# EAGLE design xns-ip67-ESP12 (EAGLE 8.0.2)
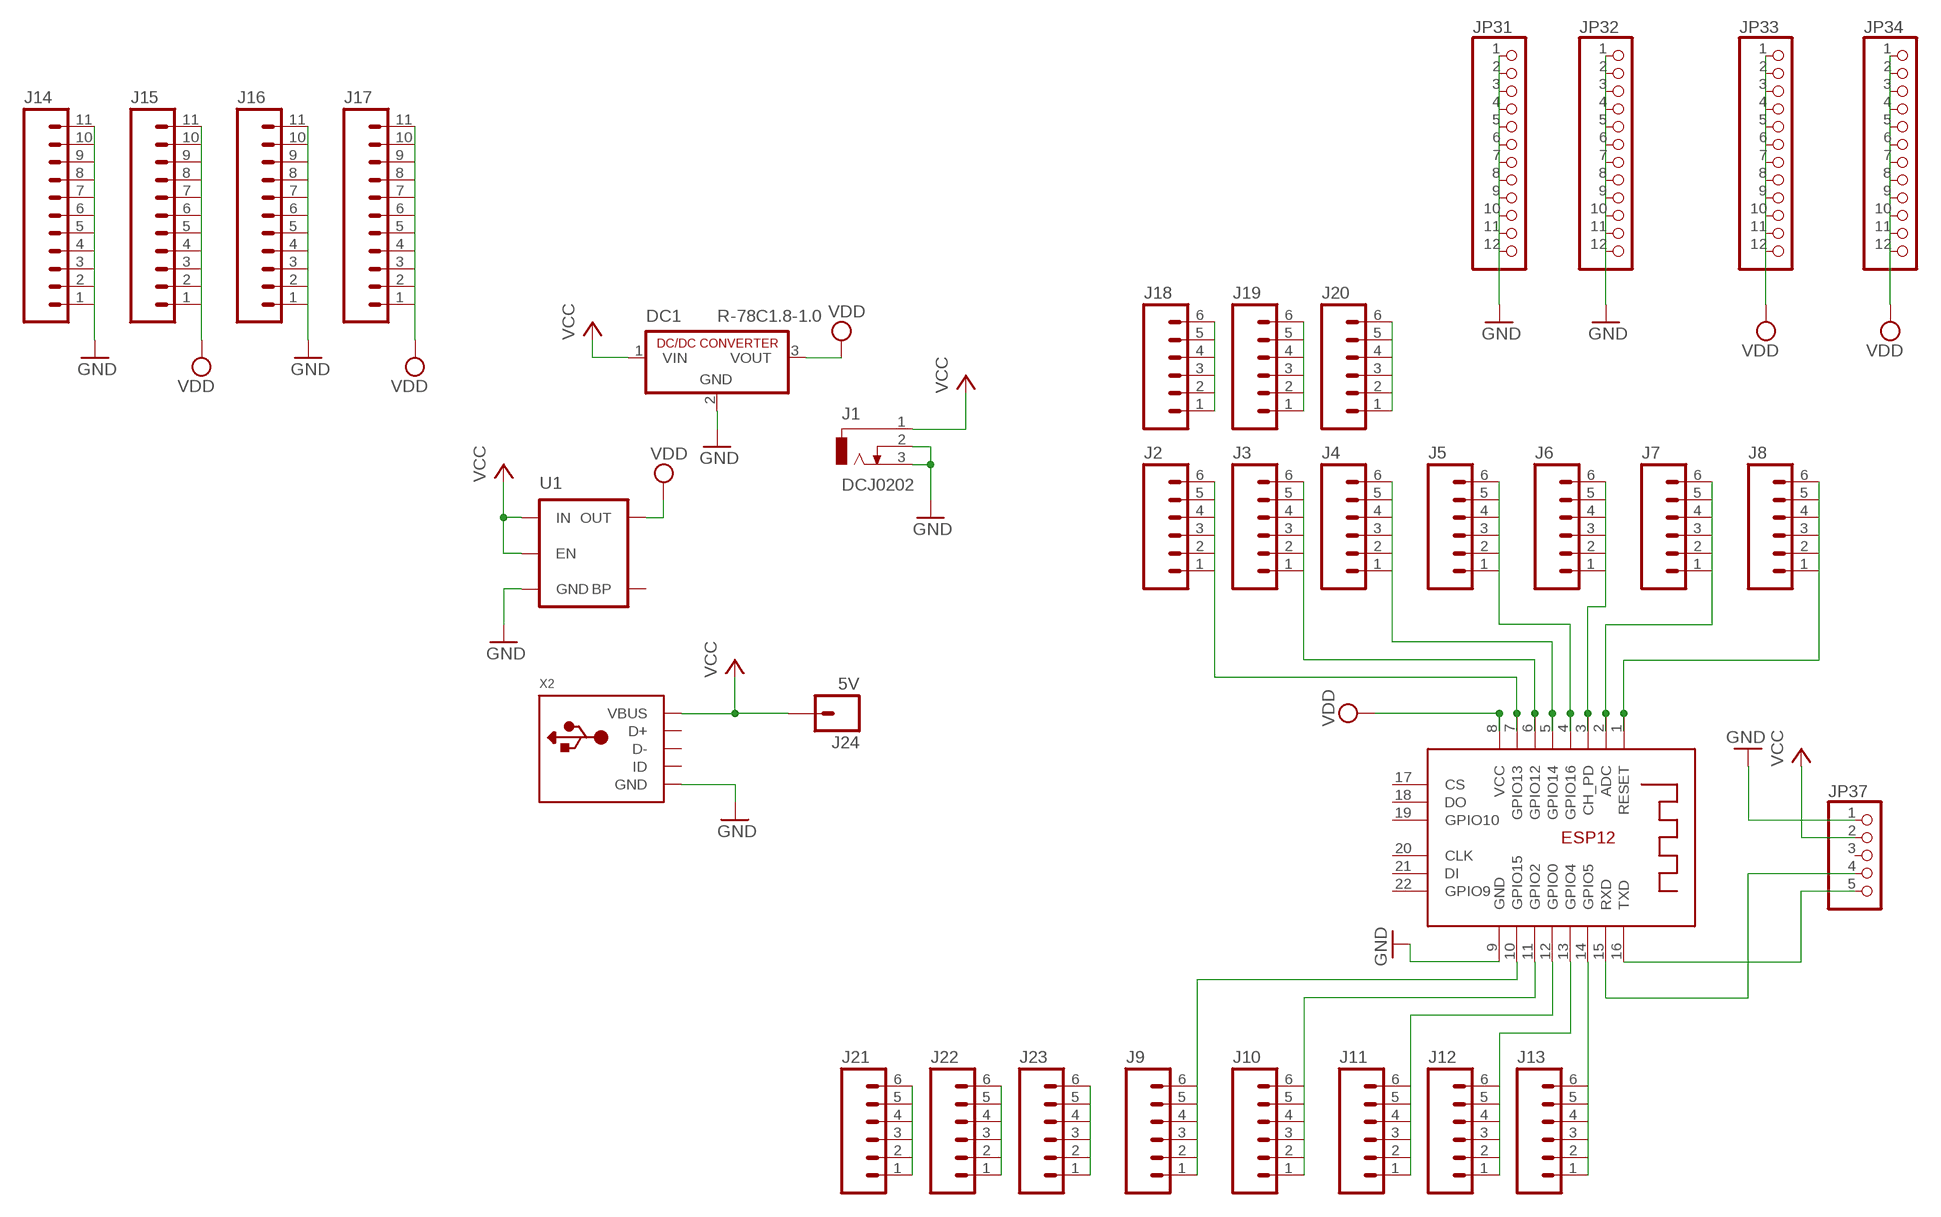
[diagram p0: schematic, sheet 1, part 1 of 2]
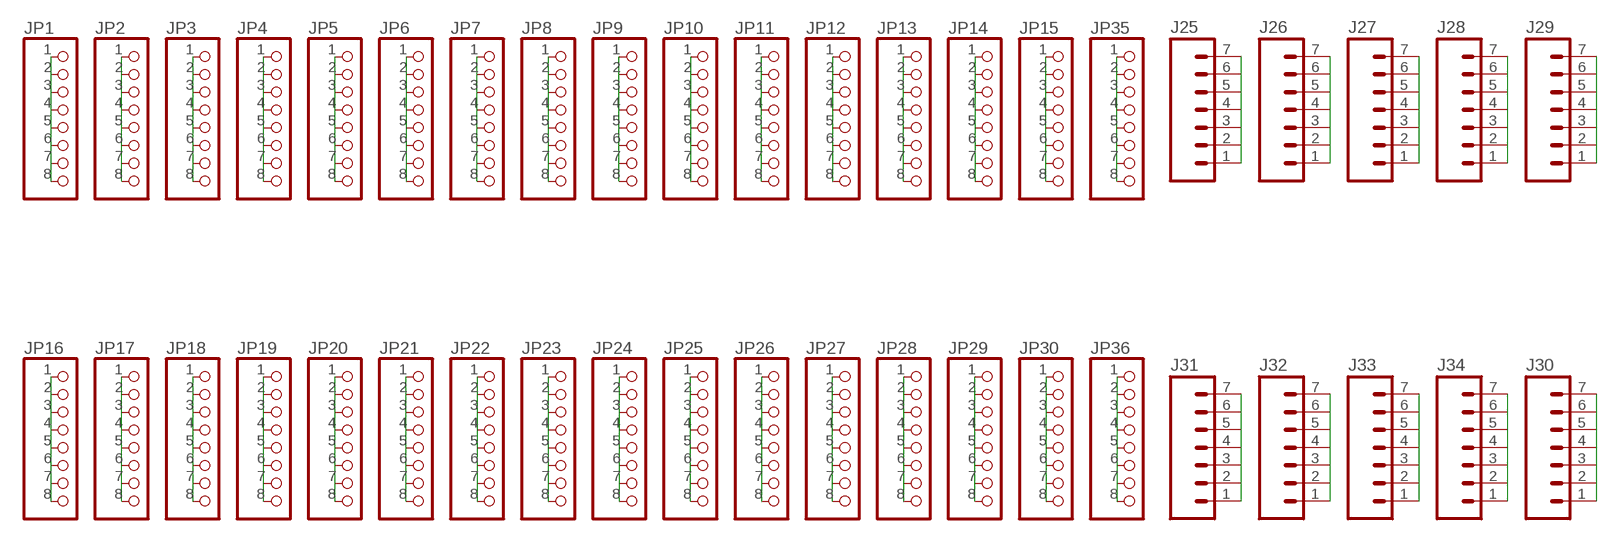
[diagram p1: schematic, sheet 1, part 2 of 2]

## Parts
DC1  R-78C1.8-1.0  [SIP3]
J1  DCJ0202  [DCJ0202]
J2  M06NO_SILK_FEMALE_PTH  [1X06_NO_SILK]
J3  M06NO_SILK_FEMALE_PTH  [1X06_NO_SILK]
J4  M06NO_SILK_FEMALE_PTH  [1X06_NO_SILK]
J5  M06NO_SILK_FEMALE_PTH  [1X06_NO_SILK]
J6  M06NO_SILK_FEMALE_PTH  [1X06_NO_SILK]
J7  M06NO_SILK_FEMALE_PTH  [1X06_NO_SILK]
J8  M06NO_SILK_FEMALE_PTH  [1X06_NO_SILK]
J9  M06NO_SILK_FEMALE_PTH  [1X06_NO_SILK]
J10  M06NO_SILK_FEMALE_PTH  [1X06_NO_SILK]
J11  M06NO_SILK_FEMALE_PTH  [1X06_NO_SILK]
J12  M06NO_SILK_FEMALE_PTH  [1X06_NO_SILK]
J13  M06NO_SILK_FEMALE_PTH  [1X06_NO_SILK]
J14  M111X11_NO_SILK  [1X11_NO_SILK]
J15  M111X11_NO_SILK  [1X11_NO_SILK]
J16  M111X11_NO_SILK  [1X11_NO_SILK]
J17  M111X11_NO_SILK  [1X11_NO_SILK]
J18  M06NO_SILK_FEMALE_PTH  [1X06_NO_SILK]
J19  M06NO_SILK_FEMALE_PTH  [1X06_NO_SILK]
J20  M06NO_SILK_FEMALE_PTH  [1X06_NO_SILK]
J21  M06NO_SILK_FEMALE_PTH  [1X06_NO_SILK]
J22  M06NO_SILK_FEMALE_PTH  [1X06_NO_SILK]
J23  M06NO_SILK_FEMALE_PTH  [1X06_NO_SILK]
J24  5V  M01PTH_NO_SILK_YES_STOP  [1X01_NO_SILK]
J25  M07NO_SILK  [1X07_NO_SILK]
J26  M07NO_SILK  [1X07_NO_SILK]
J27  M07NO_SILK  [1X07_NO_SILK]
J28  M07NO_SILK  [1X07_NO_SILK]
J29  M07NO_SILK  [1X07_NO_SILK]
J30  M07NO_SILK  [1X07_NO_SILK]
J31  M07NO_SILK  [1X07_NO_SILK]
J32  M07NO_SILK  [1X07_NO_SILK]
J33  M07NO_SILK  [1X07_NO_SILK]
J34  M07NO_SILK  [1X07_NO_SILK]
JP1  PINHD-1X8CLEANBIG  [1X08-CLEANBIG]
JP2  PINHD-1X8CLEANBIG  [1X08-CLEANBIG]
JP3  PINHD-1X8CLEANBIG  [1X08-CLEANBIG]
JP4  PINHD-1X8CLEANBIG  [1X08-CLEANBIG]
JP5  PINHD-1X8CLEANBIG  [1X08-CLEANBIG]
JP6  PINHD-1X8CLEANBIG  [1X08-CLEANBIG]
JP7  PINHD-1X8CLEANBIG  [1X08-CLEANBIG]
JP8  PINHD-1X8CLEANBIG  [1X08-CLEANBIG]
JP9  PINHD-1X8CLEANBIG  [1X08-CLEANBIG]
JP10  PINHD-1X8CLEANBIG  [1X08-CLEANBIG]
JP11  PINHD-1X8CLEANBIG  [1X08-CLEANBIG]
JP12  PINHD-1X8CLEANBIG  [1X08-CLEANBIG]
JP13  PINHD-1X8CLEANBIG  [1X08-CLEANBIG]
JP14  PINHD-1X8CLEANBIG  [1X08-CLEANBIG]
JP15  PINHD-1X8CLEANBIG  [1X08-CLEANBIG]
JP16  PINHD-1X8CLEANBIG  [1X08-CLEANBIG]
JP17  PINHD-1X8CLEANBIG  [1X08-CLEANBIG]
JP18  PINHD-1X8CLEANBIG  [1X08-CLEANBIG]
JP19  PINHD-1X8CLEANBIG  [1X08-CLEANBIG]
JP20  PINHD-1X8CLEANBIG  [1X08-CLEANBIG]
JP21  PINHD-1X8CLEANBIG  [1X08-CLEANBIG]
JP22  PINHD-1X8CLEANBIG  [1X08-CLEANBIG]
JP23  PINHD-1X8CLEANBIG  [1X08-CLEANBIG]
JP24  PINHD-1X8CLEANBIG  [1X08-CLEANBIG]
JP25  PINHD-1X8CLEANBIG  [1X08-CLEANBIG]
JP26  PINHD-1X8CLEANBIG  [1X08-CLEANBIG]
JP27  PINHD-1X8CLEANBIG  [1X08-CLEANBIG]
JP28  PINHD-1X8CLEANBIG  [1X08-CLEANBIG]
JP29  PINHD-1X8CLEANBIG  [1X08-CLEANBIG]
JP30  PINHD-1X8CLEANBIG  [1X08-CLEANBIG]
JP31  HEADER-1X12  [1X12_ROUND]
JP32  HEADER-1X12  [1X12_ROUND]
JP33  HEADER-1X12  [1X12_ROUND]
JP34  HEADER-1X12  [1X12_ROUND]
JP35  PINHD-1X8CLEANBIG  [1X08-CLEANBIG]
JP36  PINHD-1X8CLEANBIG  [1X08-CLEANBIG]
JP37  PINHD-1X5  [1X05]
U1  MIC52053.3V  [SOT23-5]
X1  ESP-12E  [ESP-12E]
X2  USBMICRO_20329  [4UCONN_20329]

## Nets
GND: DC1.2(GND) J1.2 J1.3 J14.1 J14.2 J14.3 J14.4 J14.5 J14.6 J14.7 J14.8 J14.9 J14.10 J14.11 J16.1 J16.2 J16.3 J16.4 J16.5 J16.6 J16.7 J16.8 J16.9 J16.10 J16.11 JP31.1 JP31.2 JP31.3 JP31.4 JP31.5 JP31.6 JP31.7 JP31.8 JP31.9 JP31.10 JP31.11 JP31.12 JP32.1 JP32.2 JP32.3 JP32.4 JP32.5 JP32.6 JP32.7 JP32.8 JP32.9 JP32.10 JP32.11 JP32.12 JP37.1 U1.2(GND) X1.9(GND) X2.BASE@1(GND) X2.BASE@2(GND) X2.GND X2.SPRT@1(GND) X2.SPRT@2(GND) X2.SPRT@3(GND) X2.SPRT@4(GND)
N$1: J2.1 J2.2 J2.3 J2.4 J2.5 J2.6 X1.7(GPIO13)
N$2: J3.1 J3.2 J3.3 J3.4 J3.5 J3.6 X1.6(GPIO12)
N$3: J4.1 J4.2 J4.3 J4.4 J4.5 J4.6 X1.5(GPIO14)
N$4: JP37.5 X1.16(TXD)
N$5: J5.1 J5.2 J5.3 J5.4 J5.5 J5.6 X1.4(GPIO16)
N$6: J6.1 J6.2 J6.3 J6.4 J6.5 J6.6 X1.3(CH_PD)
N$7: JP23.1 JP23.2 JP23.3 JP23.4 JP23.5 JP23.6 JP23.7 JP23.8
N$8: J7.1 J7.2 J7.3 J7.4 J7.5 J7.6 X1.2(ADC)
N$9: J8.1 J8.2 J8.3 J8.4 J8.5 J8.6 X1.1(RESET)
N$10: J9.1 J9.2 J9.3 J9.4 J9.5 J9.6 X1.10(GPIO15)
N$11: J10.1 J10.2 J10.3 J10.4 J10.5 J10.6 X1.11(GPIO2)
N$12: J11.1 J11.2 J11.3 J11.4 J11.5 J11.6 X1.12(GPIO0)
N$13: JP37.4 X1.15(RXD)
N$14: J12.1 J12.2 J12.3 J12.4 J12.5 J12.6 X1.13(GPIO4)
N$15: J13.1 J13.2 J13.3 J13.4 J13.5 J13.6 X1.14(GPIO5)
N$16: J18.1 J18.2 J18.3 J18.4 J18.5 J18.6
N$17: J19.1 J19.2 J19.3 J19.4 J19.5 J19.6
N$18: J20.1 J20.2 J20.3 J20.4 J20.5 J20.6
N$19: J21.1 J21.2 J21.3 J21.4 J21.5 J21.6
N$20: J22.1 J22.2 J22.3 J22.4 J22.5 J22.6
N$21: JP1.1 JP1.2 JP1.3 JP1.4 JP1.5 JP1.6 JP1.7 JP1.8
N$22: JP2.1 JP2.2 JP2.3 JP2.4 JP2.5 JP2.6 JP2.7 JP2.8
N$23: JP3.1 JP3.2 JP3.3 JP3.4 JP3.5 JP3.6 JP3.7 JP3.8
N$24: JP4.1 JP4.2 JP4.3 JP4.4 JP4.5 JP4.6 JP4.7 JP4.8
N$25: JP5.1 JP5.2 JP5.3 JP5.4 JP5.5 JP5.6 JP5.7 JP5.8
N$26: JP6.1 JP6.2 JP6.3 JP6.4 JP6.5 JP6.6 JP6.7 JP6.8
N$27: JP7.1 JP7.2 JP7.3 JP7.4 JP7.5 JP7.6 JP7.7 JP7.8
N$28: JP8.1 JP8.2 JP8.3 JP8.4 JP8.5 JP8.6 JP8.7 JP8.8
N$29: JP9.1 JP9.2 JP9.3 JP9.4 JP9.5 JP9.6 JP9.7 JP9.8
N$30: JP10.1 JP10.2 JP10.3 JP10.4 JP10.5 JP10.6 JP10.7 JP10.8
N$31: JP11.1 JP11.2 JP11.3 JP11.4 JP11.5 JP11.6 JP11.7 JP11.8
N$32: JP12.1 JP12.2 JP12.3 JP12.4 JP12.5 JP12.6 JP12.7 JP12.8
N$33: JP13.1 JP13.2 JP13.3 JP13.4 JP13.5 JP13.6 JP13.7 JP13.8
N$34: JP14.1 JP14.2 JP14.3 JP14.4 JP14.5 JP14.6 JP14.7 JP14.8
N$35: JP15.1 JP15.2 JP15.3 JP15.4 JP15.5 JP15.6 JP15.7 JP15.8
N$36: JP30.1 JP30.2 JP30.3 JP30.4 JP30.5 JP30.6 JP30.7 JP30.8
N$37: JP29.1 JP29.2 JP29.3 JP29.4 JP29.5 JP29.6 JP29.7 JP29.8
N$38: JP28.1 JP28.2 JP28.3 JP28.4 JP28.5 JP28.6 JP28.7 JP28.8
N$39: JP27.1 JP27.2 JP27.3 JP27.4 JP27.5 JP27.6 JP27.7 JP27.8
N$40: JP26.1 JP26.2 JP26.3 JP26.4 JP26.5 JP26.6 JP26.7 JP26.8
N$41: JP25.1 JP25.2 JP25.3 JP25.4 JP25.5 JP25.6 JP25.7 JP25.8
N$42: JP24.1 JP24.2 JP24.3 JP24.4 JP24.5 JP24.6 JP24.7 JP24.8
N$43: JP22.1 JP22.2 JP22.3 JP22.4 JP22.5 JP22.6 JP22.7 JP22.8
N$44: JP21.1 JP21.2 JP21.3 JP21.4 JP21.5 JP21.6 JP21.7 JP21.8
N$45: JP20.1 JP20.2 JP20.3 JP20.4 JP20.5 JP20.6 JP20.7 JP20.8
N$46: JP19.1 JP19.2 JP19.3 JP19.4 JP19.5 JP19.6 JP19.7 JP19.8
N$47: JP18.1 JP18.2 JP18.3 JP18.4 JP18.5 JP18.6 JP18.7 JP18.8
N$48: JP17.1 JP17.2 JP17.3 JP17.4 JP17.5 JP17.6 JP17.7 JP17.8
N$49: JP16.1 JP16.2 JP16.3 JP16.4 JP16.5 JP16.6 JP16.7 JP16.8
N$50: JP35.1 JP35.2 JP35.3 JP35.4 JP35.5 JP35.6 JP35.7 JP35.8
N$51: JP36.1 JP36.2 JP36.3 JP36.4 JP36.5 JP36.6 JP36.7 JP36.8
N$52: J31.1 J31.2 J31.3 J31.4 J31.5 J31.6 J31.7
N$54: J32.1 J32.2 J32.3 J32.4 J32.5 J32.6 J32.7
N$56: J33.1 J33.2 J33.3 J33.4 J33.5 J33.6 J33.7
N$58: J34.1 J34.2 J34.3 J34.4 J34.5 J34.6 J34.7
N$70: J23.1 J23.2 J23.3 J23.4 J23.5 J23.6
N$71: J25.1 J25.2 J25.3 J25.4 J25.5 J25.6 J25.7
N$72: J26.1 J26.2 J26.3 J26.4 J26.5 J26.6 J26.7
N$73: J27.1 J27.2 J27.3 J27.4 J27.5 J27.6 J27.7
N$74: J28.1 J28.2 J28.3 J28.4 J28.5 J28.6 J28.7
N$75: J29.1 J29.2 J29.3 J29.4 J29.5 J29.6 J29.7
N$76: J30.1 J30.2 J30.3 J30.4 J30.5 J30.6 J30.7
VCC: DC1.1(VIN) J1.1 J24.1 JP37.2 U1.1(IN) U1.3(EN) X2.VBUS
VDD: DC1.3(VOUT) J15.1 J15.2 J15.3 J15.4 J15.5 J15.6 J15.7 J15.8 J15.9 J15.10 J15.11 J17.1 J17.2 J17.3 J17.4 J17.5 J17.6 J17.7 J17.8 J17.9 J17.10 J17.11 JP33.1 JP33.2 JP33.3 JP33.4 JP33.5 JP33.6 JP33.7 JP33.8 JP33.9 JP33.10 JP33.11 JP33.12 JP34.1 JP34.2 JP34.3 JP34.4 JP34.5 JP34.6 JP34.7 JP34.8 JP34.9 JP34.10 JP34.11 JP34.12 U1.5(OUT) X1.8(VCC)
Unconnected: JP37.3 U1.4(BP) X1.17(CS) X1.18(DO) X1.19(GPIO10) X1.20(CLK) X1.21(DI) X1.22(GPIO9) X2.D+ X2.D- X2.ID

## Library data of the parts
DC1 = dc-dc-converter:R-78C*-1.0: INNOLINE DC/DC-Converter 1.0 AMP SIP3 Single Output Source: Data sheet <http://www.mikrocontroller.net/attachment/150645/157764-da-01-en-DC_DC_WANDLER_R_78C5_0_1_0.pdf>
J1 = con-jack:DCJ0202: DC POWER JACK Source: DCJ0202.pdf; OC_FARNELL: unknown; OC_NEWARK: unknown
J2-J13 J18-J23 = SparkFun-Connectors:M06: Header 6 Standard 6-pin 0.1" header. Use with straight break away headers (SKU : PRT-00116), right angle break away headers (PRT-00553), swiss pins (PRT-00743), machine pins (PRT-00117), and female headers (PRT-00115). Molex polarized connector foot print use with SKU : PRT-08094 with associated crimp pins and housings. NOTES ON THE VARIANTS LOCK and LOCK_LONGPADS... This footprint was designed to help hold the alignment of a through-hole component (i.e. 6-pin header) while soldering it into place. You may notice that each hole has been shifted either up or down by 0.005 of an inch from it's more standard position (which is a perfectly straight line). This slight alteration caused the pins (the squares in the middle) to touch the edges of the holes. Because they are alternating, it causes a "brace" to hold the component in place. 0.005 has proven to be the perfect amount of "off-center" position when using our standard breakaway headers. Although looks a little odd when you look at the bare footprint, once you have a header in there, the alteration is very hard to notice. Also,if you push a header all the way into place, it is covered up entirely on the bottom side. This idea of altering the position of holes to aid alignment will be further integrated into the Sparkfun Library for other footprints. It can help hold any component with 3 or more connection pins.; PROD_ID: CONN-08437
J14-J17 = SparkFun-Connectors:M11: Header 11 Standard 11-pin 0.1" header. Use with straight break away headers (SKU : PRT-00116), right angle break away headers (PRT-00553), swiss pins (PRT-00743), machine pins (PRT-00117), and female headers (PRT-00115).
J24 = SparkFun-Connectors:M01: Header 1 Standard 1-pin 0.1" header. Use with straight break away headers (SKU : PRT-00116), right angle break away headers (PRT-00553), swiss pins (PRT-00743), machine pins (PRT-00117), and female headers (PRT-00115). SMTSO-256-ET is a "flush mount" nut for a 4-40 screw. The older package used to be too tight, and did not allow it to sit properly thru the drill hit. The latest (0.165DIA) fits nice and snug.
J25-J34 = SparkFun-Connectors:M07: Header 7 Standard 7-pin 0.1" header. Use with straight break away headers (SKU : PRT-00116), right angle break away headers (PRT-00553), swiss pins (PRT-00743), machine pins (PRT-00117), and female headers (PRT-00115). NOTES ON THE VARIANTS LOCK and LOCK_LONGPADS... This footprint was designed to help hold the alignment of a through-hole component (i.e. 7-pin header) while soldering it into place. You may notice that each hole has been shifted either up or down by 0.005 of an inch from it's more standard position (which is usually a perfectly straight line). This slight alteration caused the pins (the squares in the middle) to touch the edges of the holes. Because they are alternating, it causes a "brace" to hold the header in place. 0.005 has proven to be the perfect amount of "off-center" position when using our standard breakaway headers. Although looks a little odd when you look at the bare footprint, once you have a header in there, the alteration is very hard to notice. Also, if you push a header all the way into place, it is covered up entirely on the bottom side. This idea of altering the position of holes to aid alignment will be further integrated into the Sparkfun Library for other footprints. It can help hold any component with 3 or more connection pins.
JP1-JP30 JP35 JP36 = adafruit:PINHD-1X8: PIN HEADER
JP31-JP34 = microbuilder:HEADER-1X12
JP37 = pinhead:PINHD-1X5: PIN HEADER
U1 = SparkFun-PowerIC:MIC5205: MIC5205 150mA vreg 3.3V - VREG-00822 5V - VREG-00823; PROD_ID: VREG-00822
X1 = microbuilder:ESP-12E
X2 = microbuilder:USB: USB Connectors USBMINIB - Surface Mount Female Mini-B USB Connector 4UConnector: 06564

## Net classes
0 default: width 0.508 mm, drill 0.508 mm, clearance 0.254 mm

## Board
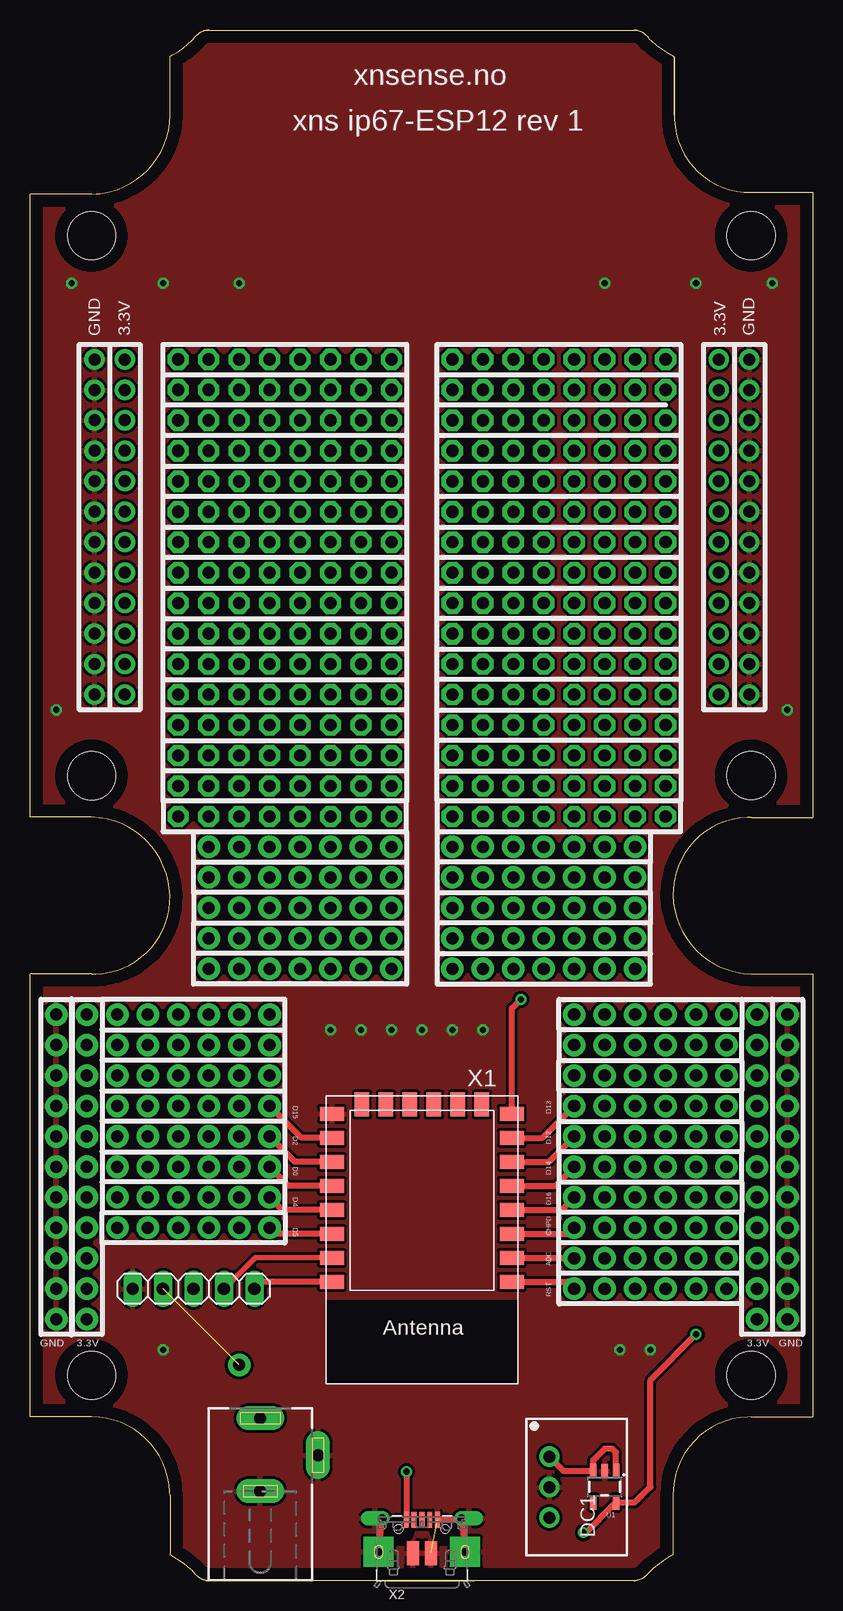
[diagram p2: board, top side]
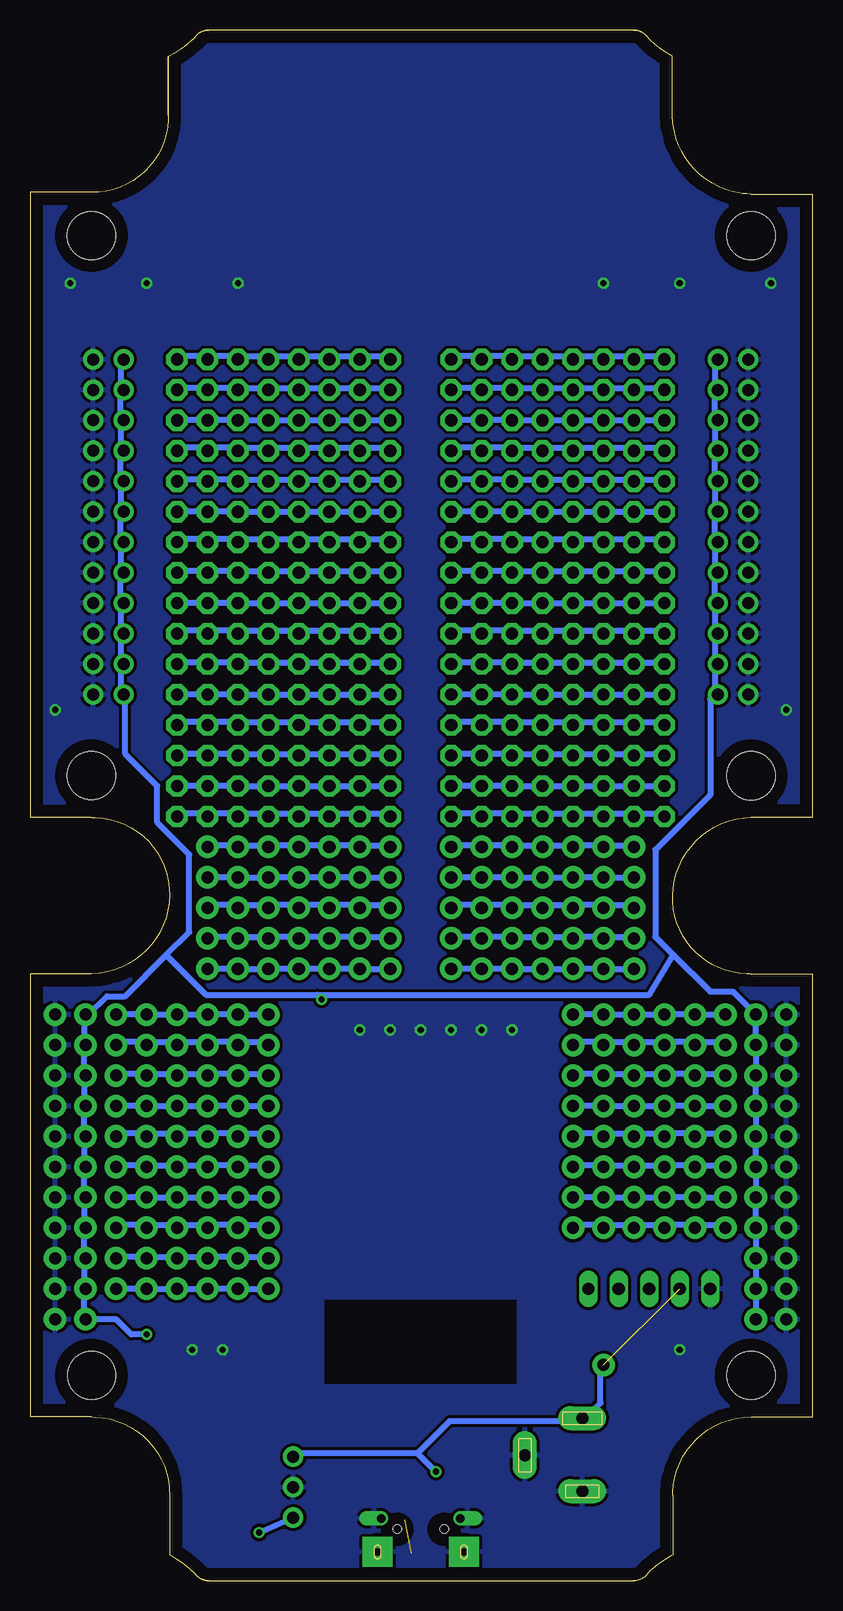
[diagram p3: board, bottom side, seen from below]

Size 65.26 x 129.28 mm. Coordinates in mm from the lower left corner, seen from the top.
Outline: 13.87,128.8 arc-48 14.94,129.28 50.35,129.28
Outline: 51.42,128.8 arc48 50.35,129.28
Outline: 51.41,0.49 arc-48 50.35,0.02 14.94,0.02
Outline: 13.88,0.48 arc48 14.94,0
Outline: 53.72,122.19 53.72,127.05
Outline: 50.34,129.28 50.36,129.28 arc-41 51.27,128.94 arc-10 51.55,128.65 arc10 51.78,128.41 arc13 53.73,127.04 53.73,122.3 arc2 53.74,121.8 arc88 60.13,115.74 65.26,115.74 65.26,63.65 60.14,63.65
Outline: 60.13,63.65 59.81,63.64 arc89 53.62,57.14 arc88 60.13,50.61 65.26,50.61 65.26,13.66 60.13,13.66 59.82,13.65 arc89 53.62,7.11 53.62,2.19 53.53,2.14 arc17 51.51,0.59 arc-8 51.14,0.26 arc-17 50.87,0.11 arc-19 50.42,0.02 14.95,0.02 arc-52 13.73,0.62 arc11 13.39,0.98 arc10 11.68,2.17
Outline: 11.67,2.18 11.67,7.13 11.66,7.39 arc88 5.13,13.67 0,13.67 0,50.6 5.14,50.6 5.5,50.61 arc90 11.67,57.14 arc87 5.14,63.66 0.01,63.66 0.01,115.61 5.14,115.61 5.5,115.62 arc7 6.05,115.67 arc80 11.68,122.13 11.68,127.08 11.91,127.21 arc19 13.87,128.79 arc-47 14.93,129.28 50.33,129.28
Copper layers (1*16): Top 0.035mm / dielectric 1.5mm / Bottom 0.035mm
Design rules "default *": minimum track width 0.5mm, minimum drill 20mil, track to track 8mil, track to pad 8mil, pad to pad 8mil, via to via 8mil, smd to smd 8mil, copper to edge 40mil, drill to drill 8mil, minimum pad ring 10mil, minimum via ring 8mil, stop-mask expansion 4mil, vias tented up to drill 0mil, thermal gap 10mil
Holes 4 mm at 5.14,112.13 60.13,112.14 5.14,67.12 60.13,67.13 5.14,17.14 60.12,17.14

### Footprints (pad centres in the part's own frame; a part is rotated, then mirrored left to right if it is on the bottom)
SIP3 = drill 1 pad 1.676: 1 -2.54,0; 2 0,0; 3 2.54,0
DCJ0202 = drill 1 pad 2 long: 1 0,3.1; 2 4.8,0; 3 0,-3
1X06_NO_SILK = drill 1.016 pad 1.88: 1 0,0; 2 2.54,0; 3 5.08,0; 4 7.62,0; 5 10.16,0; 6 12.7,0
1X11_NO_SILK = drill 1.016 pad 1.88: 1 0,0; 2 2.54,0; 3 5.08,0; 4 7.62,0; 5 10.16,0; 6 12.7,0; 7 15.24,0; 8 17.78,0; 9 20.32,0; 10 22.86,0; 11 25.4,0
1X01_NO_SILK = drill 1.016 pad 1.88: 1 0,0
1X07_NO_SILK = drill 1.016 pad 1.88: 1 0,0; 2 2.54,0; 3 5.08,0; 4 7.62,0; 5 10.16,0; 6 12.7,0; 7 15.24,0
1X08-CLEANBIG = drill 1.016 pad 1.778 octagon: 1 -8.89,0; 2 -6.35,0; 3 -3.81,0; 4 -1.27,0; 5 1.27,0; 6 3.81,0; 7 6.35,0; 8 8.89,0
1X12_ROUND = drill 1 pad 1.676: 1 -13.97,0; 2 -11.43,0; 3 -8.89,0; 4 -6.35,0; 5 -3.81,0; 6 -1.27,0; 7 1.27,0; 8 3.81,0; 9 6.35,0; 10 8.89,0; 11 11.43,0; 12 13.97,0
1X05 = drill 1.016 long: 1 -5.08,0; 2 -2.54,0; 3 0,0; 4 2.54,0; 5 5.08,0
SOT23-5 = smd 0.55 x 1.2: 1 -0.95,-1.3; 2 0,-1.3; 3 0.95,-1.3; 4 0.95,1.3; 5 -0.95,1.3
ESP-12E = smd 2 x 1.2: 1 -7.5,5.77; 2 -7.5,3.77; 3 -7.5,1.77; 4 -7.5,-0.23; 5 -7.5,-2.23; 6 -7.5,-4.23; 7 -7.5,-6.23; 8 -7.5,-8.23; 9 7.5,-8.23; 10 7.5,-6.23; 11 7.5,-4.23; 12 7.5,-2.23; 13 7.5,-0.23; 14 7.5,1.77; 15 7.5,3.77; 16 7.5,5.77 | smd 1.2 x 2: 17 -5,-9; 18 -3,-9; 19 -1,-9; 20 1,-9; 21 3,-9; 22 5,-9
4UCONN_20329 = smd 1 x 2: BASE@1 -0.75,-2; BASE@2 0.75,-2 | smd 0.4 x 1.35: D+ 0,0.775; D- -0.65,0.775; GND 1.3,0.775; ID 0.65,0.775; VBUS -1.3,0.775 | drill 0.7 offset: SPRT@1 -3.3,0.9; SPRT@2 3.3,0.9 | drill 0.6 pad 2.5 square: SPRT@3 -3.6,-1.9; SPRT@4 3.6,-1.9 | hole 0.7: -1.95,0; 1.95,0

### Placement (x,y rotation side)
DC1  43.31,7.82 270 top
J1  19.2,10.47 0 top
J2  45.38,39.59 0 top
J3  45.38,37.05 0 top
J4  45.38,34.51 0 top
J5  45.38,31.97 0 top
J6  45.38,29.43 0 top
J7  45.38,26.89 0 top
J8  45.38,24.35 0 top
J9  7.28,39.59 0 top
J10  7.28,37.05 0 top
J11  7.28,34.51 0 top
J12  7.28,31.97 0 top
J13  7.28,29.43 0 top
J14  2.2,21.81 90 top
J15  4.74,21.81 90 top
J16  63.16,21.81 90 top
J17  60.62,21.81 90 top
J18  7.28,47.21 0 top
J19  7.28,44.67 0 top
J20  7.28,42.13 0 top
J21  45.38,47.21 0 top
J22  45.38,44.67 0 top
J23  45.38,42.13 0 top
J24  17.44,18 0 top
J25  14.9,61.18 0 top
J26  14.9,58.64 0 top
J27  14.9,56.1 0 top
J28  14.9,53.56 0 top
J29  14.9,51.02 0 top
J30  35.22,61.18 0 top
J31  35.22,58.64 0 top
J32  35.22,56.1 0 top
J33  35.22,53.56 0 top
J34  35.22,51.02 0 top
JP1  21.25,101.82 0 top
JP2  21.25,99.28 0 top
JP3  21.25,96.74 0 top
JP4  21.25,94.2 0 top
JP5  21.25,91.66 0 top
JP6  21.25,89.12 0 top
JP7  21.25,86.58 0 top
JP8  21.25,84.04 0 top
JP9  21.25,81.5 0 top
JP10  21.25,78.96 0 top
JP11  21.25,76.42 0 top
JP12  21.25,73.88 0 top
JP13  21.25,71.34 0 top
JP14  21.25,68.8 0 top
JP15  21.25,66.26 0 top
JP16  44.11,66.26 0 top
JP17  44.11,68.8 0 top
JP18  44.11,71.34 0 top
JP19  44.11,73.88 0 top
JP20  44.11,76.42 0 top
JP21  44.11,78.96 0 top
JP22  44.11,81.5 0 top
JP23  44.11,84.04 0 top
JP24  44.11,86.58 0 top
JP25  44.11,89.12 0 top
JP26  44.11,91.66 0 top
JP27  44.11,94.2 0 top
JP28  44.11,96.74 0 top
JP29  44.11,99.28 0 top
JP30  44.11,101.82 0 top
JP31  5.38,87.85 90 top
JP32  59.98,87.85 90 top
JP33  57.44,87.85 90 top
JP34  7.91,87.85 90 top
JP35  21.25,63.72 0 top
JP36  44.11,63.72 0 top
JP37  13.63,24.35 0 top
U1  47.92,7.84 180 top
X1  32.68,30.7 180 top
X2  32.68,4.31 0 top

### Tracks (layer width: path | path; a pad name or v marks a point on that pad's centre or on a via)
GND  (via drill 0.51)  (1 unrouted)
  Top 0.508: X2.SPRT@3 X2.SPRT@1 | X2.GND X2.SPRT@2 X2.SPRT@4
  other vias: 3.47,108.17 11.09,108.17 2.2,72.61 17.44,108.17 11.09,19.27 49.19,19.27 51.73,19.27 63.16,72.61 47.92,108.17 55.54,108.17 61.89,108.17 25.06,45.94 27.6,45.94 32.68,45.94 30.14,45.94 35.22,45.94 37.76,45.94
  pour Bottom: -5.42,-1.05 68.24,-1.05 68.24,132.3 -5.42,132.3
  pour Top: -4.15,133.57 68.24,133.57 68.24,-2.32 -4.15,-2.32
N$1
  Top 0.508: X1.7 42.72,36.93 J2.1
  Bottom 0.508: J2.1 J2.2 J2.3 J2.4 J2.5 J2.6
N$2
  Top 0.508: X1.6 43.26,34.93 J3.1
  Bottom 0.508: J3.1 45.51,37.31 47.79,37.31 J3.2 48.17,37.31 50.46,37.31 | J3.6 58.08,37.31 55.79,37.31 J3.5 55.41,37.31 53.13,37.31 J3.4 52.75,37.31 50.46,37.31 | 50.46,37.31 J3.3
N$3
  Top 0.508: X1.5 43.8,32.93 J4.1
  Bottom 0.508: J4.1 45.51,34.64 47.79,34.64 J4.2 48.17,34.64 50.46,34.64 | J4.6 58.08,34.64 55.79,34.64 J4.5 55.41,34.64 53.13,34.64 J4.4 52.75,34.64 50.46,34.64 | 50.46,34.64 J4.3
N$4
  Top 0.508: X1.16 19.4,24.93 JP37.5
N$5
  Top 0.508: X1.4 44.34,30.93 J5.1
  Bottom 0.508: J5.1 J5.2 J5.3 J5.4 J5.5 J5.6
N$6
  Top 0.508: X1.3 44.88,28.93 J6.1
  Bottom 0.508: J6.1 45.51,29.69 47.79,29.69 J6.2 48.17,29.69 50.46,29.69 | J6.6 58.08,29.69 55.79,29.69 J6.5 55.41,29.69 53.13,29.69 J6.4 52.75,29.69 50.46,29.69 | 50.46,29.69 J6.3
N$7
  Bottom 0.508: JP23.1 35.22,84.17 37.51,84.17 JP23.2 37.89,84.17 40.17,84.17 JP23.3 40.55,84.17 42.84,84.17 | 50.46,84.17 48.17,84.17 JP23.6 47.79,84.17 45.51,84.17 JP23.5 45.13,84.17 42.84,84.17 | 50.46,84.17 52.75,84.17 JP23.8 | 50.46,84.17 JP23.7 | 42.84,84.17 JP23.4
N$8
  Top 0.508: 45.35,26.86 J7.1 45.34,26.93 X1.2
  Bottom 0.508: J7.1 45.51,27.02 47.79,27.02 J7.2 48.17,27.02 50.46,27.02 | J7.6 58.08,27.02 55.79,27.02 J7.5 55.41,27.02 53.13,27.02 J7.4 52.75,27.02 50.46,27.02 | 50.46,27.02 J7.3
N$9
  Top 0.508: X1.1 44.8,24.93 J8.1
  Bottom 0.508: J8.1 J8.2 J8.3 J8.4 J8.5 J8.6
N$10
  Top 0.508: X1.10 22.64,36.93 J9.6
  Bottom 0.508: J9.1 J9.2 J9.3 J9.4 J9.5 J9.6
N$11
  Top 0.508: X1.11 22.1,34.93 J10.6
  Bottom 0.508: J10.1 7.41,37.31 9.69,37.31 J10.2 10.07,37.31 12.36,37.31 | J10.6 19.98,37.31 17.69,37.31 J10.5 17.31,37.31 15.03,37.31 J10.4 14.65,37.31 12.36,37.31 | 12.36,37.31 J10.3
N$12
  Top 0.508: X1.12 21.56,32.93 J11.6
  Bottom 0.508: J11.1 7.41,34.64 9.69,34.64 J11.2 10.07,34.64 12.36,34.64 | J11.6 19.98,34.64 17.69,34.64 J11.5 17.31,34.64 15.03,34.64 J11.4 14.65,34.64 12.36,34.64 | 12.36,34.64 J11.3
N$13
  Top 0.406: X1.15 18.75,26.93 JP37.4
N$14
  Top 0.508: X1.13 21.02,30.93 J12.6
  Bottom 0.508: J12.1 J12.2 J12.3 J12.4 J12.5 J12.6
N$15
  Top 0.508: X1.14 20.48,28.93 J13.6
  Bottom 0.508: J13.1 7.41,29.69 9.69,29.69 J13.2 10.07,29.69 12.36,29.69 | J13.6 19.98,29.69 17.69,29.69 J13.5 17.31,29.69 15.03,29.69 J13.4 14.65,29.69 12.36,29.69 | 12.36,29.69 J13.3
N$16
  Bottom 0.508: J18.1 J18.2 J18.3 J18.4 J18.5 J18.6
N$17
  Bottom 0.508: J19.1 7.41,44.93 9.69,44.93 J19.2 10.07,44.93 12.36,44.93 | J19.6 19.98,44.93 17.69,44.93 J19.5 17.31,44.93 15.03,44.93 J19.4 14.65,44.93 12.36,44.93 | 12.36,44.93 J19.3
N$18
  Bottom 0.508: J20.1 7.41,42.26 9.69,42.26 J20.2 10.07,42.26 12.36,42.26 | J20.6 19.98,42.26 17.69,42.26 J20.5 17.31,42.26 15.03,42.26 J20.4 14.65,42.26 12.36,42.26 | 12.36,42.26 J20.3
N$19
  Bottom 0.508: J21.1 J21.2 J21.3 J21.4 J21.5 J21.6
N$20
  Bottom 0.508: J22.1 45.51,44.93 47.79,44.93 J22.2 48.17,44.93 50.46,44.93 | J22.6 58.08,44.93 55.79,44.93 J22.5 55.41,44.93 53.13,44.93 J22.4 52.75,44.93 50.46,44.93 | 50.46,44.93 J22.3
N$21
  Bottom 0.508: JP1.1 12.36,102.08 14.65,102.08 JP1.2 15.03,102.08 17.31,102.08 JP1.3 17.69,102.08 19.98,102.08 | 27.6,102.08 25.31,102.08 JP1.6 24.93,102.08 22.65,102.08 JP1.5 22.27,102.08 19.98,102.08 | 27.6,102.08 29.89,102.08 JP1.8 | 27.6,102.08 JP1.7 | 19.98,102.08 JP1.4
N$22
  Bottom 0.508: JP2.1 12.36,99.41 14.65,99.41 JP2.2 15.03,99.41 17.31,99.41 JP2.3 17.69,99.41 19.98,99.41 | 27.6,99.41 25.31,99.41 JP2.6 24.93,99.41 22.65,99.41 JP2.5 22.27,99.41 19.98,99.41 | 27.6,99.41 29.89,99.41 JP2.8 | 27.6,99.41 JP2.7 | 19.98,99.41 JP2.4
N$23
  Bottom 0.508: JP3.1 JP3.2 JP3.3 JP3.4 JP3.5 JP3.6 JP3.7 JP3.8
N$24
  Bottom 0.508: JP4.1 12.36,94.46 14.65,94.46 JP4.2 15.03,94.46 17.31,94.46 JP4.3 17.69,94.46 19.98,94.46 | 27.6,94.46 25.31,94.46 JP4.6 24.93,94.46 22.65,94.46 JP4.5 22.27,94.46 19.98,94.46 | 27.6,94.46 29.89,94.46 JP4.8 | 27.6,94.46 JP4.7 | 19.98,94.46 JP4.4
N$25
  Bottom 0.508: JP5.1 12.36,91.79 14.65,91.79 JP5.2 15.03,91.79 17.31,91.79 JP5.3 17.69,91.79 19.98,91.79 | 27.6,91.79 25.31,91.79 JP5.6 24.93,91.79 22.65,91.79 JP5.5 22.27,91.79 19.98,91.79 | 27.6,91.79 29.89,91.79 JP5.8 | 27.6,91.79 JP5.7 | 19.98,91.79 JP5.4
N$26
  Bottom 0.508: JP6.1 JP6.2 JP6.3 JP6.4 JP6.5 JP6.6 JP6.7 JP6.8
N$27
  Bottom 0.508: JP7.1 12.36,86.84 14.65,86.84 JP7.2 15.03,86.84 17.31,86.84 JP7.3 17.69,86.84 19.98,86.84 | 27.6,86.84 25.31,86.84 JP7.6 24.93,86.84 22.65,86.84 JP7.5 22.27,86.84 19.98,86.84 | 27.6,86.84 29.89,86.84 JP7.8 | 27.6,86.84 JP7.7 | 19.98,86.84 JP7.4
N$28
  Bottom 0.508: JP8.1 12.36,84.17 14.65,84.17 JP8.2 15.03,84.17 17.31,84.17 JP8.3 17.69,84.17 19.98,84.17 | 27.6,84.17 25.31,84.17 JP8.6 24.93,84.17 22.65,84.17 JP8.5 22.27,84.17 19.98,84.17 | 27.6,84.17 29.89,84.17 JP8.8 | 27.6,84.17 JP8.7 | 19.98,84.17 JP8.4
N$29
  Bottom 0.508: JP9.1 JP9.2 JP9.3 JP9.4 JP9.5 JP9.6 JP9.7 JP9.8
N$30
  Bottom 0.508: JP10.1 12.36,79.22 14.65,79.22 JP10.2 15.03,79.22 17.31,79.22 JP10.3 17.69,79.22 19.98,79.22 | 27.6,79.22 25.31,79.22 JP10.6 24.93,79.22 22.65,79.22 JP10.5 22.27,79.22 19.98,79.22 | 27.6,79.22 29.89,79.22 JP10.8 | 27.6,79.22 JP10.7 | 19.98,79.22 JP10.4
N$31
  Bottom 0.508: JP11.1 12.36,76.55 14.65,76.55 JP11.2 15.03,76.55 17.31,76.55 JP11.3 17.69,76.55 19.98,76.55 | 27.6,76.55 25.31,76.55 JP11.6 24.93,76.55 22.65,76.55 JP11.5 22.27,76.55 19.98,76.55 | 27.6,76.55 29.89,76.55 JP11.8 | 27.6,76.55 JP11.7 | 19.98,76.55 JP11.4
N$32
  Bottom 0.508: JP12.1 JP12.2 JP12.3 JP12.4 JP12.5 JP12.6 JP12.7 JP12.8
N$33
  Bottom 0.508: JP13.1 12.36,71.6 14.65,71.6 JP13.2 15.03,71.6 17.31,71.6 JP13.3 17.69,71.6 19.98,71.6 | 27.6,71.6 25.31,71.6 JP13.6 24.93,71.6 22.65,71.6 JP13.5 22.27,71.6 19.98,71.6 | 27.6,71.6 29.89,71.6 JP13.8 | 27.6,71.6 JP13.7 | 19.98,71.6 JP13.4
N$34
  Bottom 0.508: JP14.1 12.36,68.93 14.65,68.93 JP14.2 15.03,68.93 17.31,68.93 JP14.3 17.69,68.93 19.98,68.93 | 27.6,68.93 25.31,68.93 JP14.6 24.93,68.93 22.65,68.93 JP14.5 22.27,68.93 19.98,68.93 | 27.6,68.93 29.89,68.93 JP14.8 | 27.6,68.93 JP14.7 | 19.98,68.93 JP14.4
N$35
  Bottom 0.508: JP15.1 JP15.2 JP15.3 JP15.4 JP15.5 JP15.6 JP15.7 JP15.8
N$36
  Bottom 0.508: JP30.1 35.22,102.08 37.51,102.08 JP30.2 37.89,102.08 40.17,102.08 JP30.3 40.55,102.08 42.84,102.08 | 50.46,102.08 48.17,102.08 JP30.6 47.79,102.08 45.51,102.08 JP30.5 45.13,102.08 42.84,102.08 | 50.46,102.08 52.75,102.08 JP30.8 | 50.46,102.08 JP30.7 | 42.84,102.08 JP30.4
N$37
  Bottom 0.508: JP29.1 35.22,99.41 37.51,99.41 JP29.2 37.89,99.41 40.17,99.41 JP29.3 40.55,99.41 42.84,99.41 | 50.46,99.41 48.17,99.41 JP29.6 47.79,99.41 45.51,99.41 JP29.5 45.13,99.41 42.84,99.41 | 50.46,99.41 52.75,99.41 JP29.8 | 50.46,99.41 JP29.7 | 42.84,99.41 JP29.4
N$38
  Bottom 0.508: JP28.1 JP28.2 JP28.3 JP28.4 JP28.5 JP28.6 JP28.7 JP28.8
N$39
  Bottom 0.508: JP27.1 35.22,94.46 37.51,94.46 JP27.2 37.89,94.46 40.17,94.46 JP27.3 40.55,94.46 42.84,94.46 | 50.46,94.46 48.17,94.46 JP27.6 47.79,94.46 45.51,94.46 JP27.5 45.13,94.46 42.84,94.46 | 50.46,94.46 52.75,94.46 JP27.8 | 50.46,94.46 JP27.7 | 42.84,94.46 JP27.4
N$40
  Bottom 0.508: JP26.1 35.22,91.79 37.51,91.79 JP26.2 37.89,91.79 40.17,91.79 JP26.3 40.55,91.79 42.84,91.79 | 50.46,91.79 48.17,91.79 JP26.6 47.79,91.79 45.51,91.79 JP26.5 45.13,91.79 42.84,91.79 | 50.46,91.79 52.75,91.79 JP26.8 | 50.46,91.79 JP26.7 | 42.84,91.79 JP26.4
N$41
  Bottom 0.508: JP25.1 JP25.2 JP25.3 JP25.4 JP25.5 JP25.6 JP25.7 JP25.8
N$42
  Bottom 0.508: JP24.1 35.22,86.84 37.51,86.84 JP24.2 37.89,86.84 40.17,86.84 JP24.3 40.55,86.84 42.84,86.84 | 50.46,86.84 48.17,86.84 JP24.6 47.79,86.84 45.51,86.84 JP24.5 45.13,86.84 42.84,86.84 | 50.46,86.84 52.75,86.84 JP24.8 | 50.46,86.84 JP24.7 | 42.84,86.84 JP24.4
N$43
  Bottom 0.508: JP22.1 JP22.2 JP22.3 JP22.4 JP22.5 JP22.6 JP22.7 JP22.8
N$44
  Bottom 0.508: JP21.1 35.22,79.22 37.51,79.22 JP21.2 37.89,79.22 40.17,79.22 JP21.3 40.55,79.22 42.84,79.22 | 50.46,79.22 48.17,79.22 JP21.6 47.79,79.22 45.51,79.22 JP21.5 45.13,79.22 42.84,79.22 | 50.46,79.22 52.75,79.22 JP21.8 | 50.46,79.22 JP21.7 | 42.84,79.22 JP21.4
N$45
  Bottom 0.508: JP20.1 35.22,76.55 37.51,76.55 JP20.2 37.89,76.55 40.17,76.55 JP20.3 40.55,76.55 42.84,76.55 | 50.46,76.55 48.17,76.55 JP20.6 47.79,76.55 45.51,76.55 JP20.5 45.13,76.55 42.84,76.55 | 50.46,76.55 52.75,76.55 JP20.8 | 50.46,76.55 JP20.7 | 42.84,76.55 JP20.4
N$46
  Bottom 0.508: JP19.1 JP19.2 JP19.3 JP19.4 JP19.5 JP19.6 JP19.7 JP19.8
N$47
  Bottom 0.508: JP18.1 35.22,71.6 37.51,71.6 JP18.2 37.89,71.6 40.17,71.6 JP18.3 40.55,71.6 42.84,71.6 | 50.46,71.6 48.17,71.6 JP18.6 47.79,71.6 45.51,71.6 JP18.5 45.13,71.6 42.84,71.6 | 50.46,71.6 52.75,71.6 JP18.8 | 50.46,71.6 JP18.7 | 42.84,71.6 JP18.4
N$48
  Bottom 0.508: JP17.1 35.22,68.93 37.51,68.93 JP17.2 37.89,68.93 40.17,68.93 JP17.3 40.55,68.93 42.84,68.93 | 50.46,68.93 48.17,68.93 JP17.6 47.79,68.93 45.51,68.93 JP17.5 45.13,68.93 42.84,68.93 | 50.46,68.93 52.75,68.93 JP17.8 | 50.46,68.93 JP17.7 | 42.84,68.93 JP17.4
N$49
  Bottom 0.508: JP16.1 JP16.2 JP16.3 JP16.4 JP16.5 JP16.6 JP16.7 JP16.8
N$50
  Bottom 0.508: JP35.1 12.36,63.98 14.65,63.98 JP35.2 15.03,63.98 17.31,63.98 JP35.3 17.69,63.98 19.98,63.98 | 27.6,63.98 25.31,63.98 JP35.6 24.93,63.98 22.65,63.98 JP35.5 22.27,63.98 19.98,63.98 | 27.6,63.98 29.89,63.98 JP35.8 | 27.6,63.98 JP35.7 | 19.98,63.98 JP35.4
N$51
  Bottom 0.508: JP36.1 35.22,63.98 37.51,63.98 JP36.2 37.89,63.98 40.17,63.98 JP36.3 40.55,63.98 42.84,63.98 | 50.46,63.98 48.17,63.98 JP36.6 47.79,63.98 45.51,63.98 JP36.5 45.13,63.98 42.84,63.98 | 50.46,63.98 52.75,63.98 JP36.8 | 50.46,63.98 JP36.7 | 42.84,63.98 JP36.4
N$52
  Bottom 0.508: J31.7 J31.6 J31.5 J31.4 J31.3 J31.2 J31.1
N$54
  Bottom 0.508: J32.7 50.46,56.36 48.17,56.36 J32.6 47.79,56.36 45.51,56.36 J32.5 45.13,56.36 42.84,56.36 | J32.1 35.22,56.36 37.51,56.36 J32.2 37.89,56.36 40.17,56.36 J32.3 40.55,56.36 42.84,56.36 | 42.84,56.36 J32.4
N$56
  Bottom 0.508: J33.7 50.46,53.69 48.17,53.69 J33.6 47.79,53.69 45.51,53.69 J33.5 45.13,53.69 42.84,53.69 | J33.1 35.22,53.69 37.51,53.69 J33.2 37.89,53.69 40.17,53.69 J33.3 40.55,53.69 42.84,53.69 | 42.84,53.69 J33.4
N$58
  Bottom 0.508: J34.7 J34.6 J34.5 J34.4 J34.3 J34.2 J34.1
N$70
  Bottom 0.508: J23.1 45.51,42.26 47.79,42.26 J23.2 48.17,42.26 50.46,42.26 | J23.6 58.08,42.26 55.79,42.26 J23.5 55.41,42.26 53.13,42.26 J23.4 52.75,42.26 50.46,42.26 | 50.46,42.26 J23.3
N$71
  Bottom 0.508: J25.1 15.03,61.31 17.31,61.31 J25.2 17.69,61.31 19.98,61.31 | 27.6,61.31 25.31,61.31 J25.5 24.93,61.31 22.65,61.31 J25.4 22.27,61.31 19.98,61.31 | 27.6,61.31 29.89,61.31 J25.7 | 27.6,61.31 J25.6 | 19.98,61.31 J25.3
N$72
  Bottom 0.508: J26.1 J26.2 J26.3 J26.4 J26.5 J26.6 J26.7
N$73
  Bottom 0.508: J27.1 15.03,56.36 17.31,56.36 J27.2 17.69,56.36 19.98,56.36 | 27.6,56.36 25.31,56.36 J27.5 24.93,56.36 22.65,56.36 J27.4 22.27,56.36 19.98,56.36 | 27.6,56.36 29.89,56.36 J27.7 | 27.6,56.36 J27.6 | 19.98,56.36 J27.3
N$74
  Bottom 0.508: J28.1 15.03,53.69 17.31,53.69 J28.2 17.69,53.69 19.98,53.69 | 27.6,53.69 25.31,53.69 J28.5 24.93,53.69 22.65,53.69 J28.4 22.27,53.69 19.98,53.69 | 27.6,53.69 29.89,53.69 J28.7 | 27.6,53.69 J28.6 | 19.98,53.69 J28.3
N$75
  Bottom 0.508: J29.1 J29.2 J29.3 J29.4 J29.5 J29.6 J29.7
N$76
  Bottom 0.508: J30.7 50.46,61.31 48.17,61.31 J30.6 47.79,61.31 45.51,61.31 J30.5 45.13,61.31 42.84,61.31 | J30.1 35.22,61.31 37.51,61.31 J30.2 37.89,61.31 40.17,61.31 J30.3 40.55,61.31 42.84,61.31 | 42.84,61.31 J30.4
VCC  (via drill 0.51)  (1 unrouted)
  Top 0.508: v31.41,9.11 31.41,5.12 X2.VBUS | DC1.1 44.53,9.14 U1.3 46.97,10.07 47.92,11.02 48.55,11.02 48.87,10.7 U1.1
  Bottom 0.508: 32.93,10.64 43.22,10.64 DC1.1 | 32.93,10.64 30.27,13.3 19.22,13.3 J1.1 18.84,13.68 17.69,14.83 17.69,17.88 J24.1 | 32.93,10.64 v31.41,9.11
VDD  (via drill 0.51)
  Top 0.508: v46.14,4.03 46.14,3.81 U1.5 50.43,6.54 51.73,7.84 51.73,16.73 v55.54,20.54 | X1.8 40.18,47.73 v40.94,48.48
  Bottom 0.508: J15.1 J15.2 J15.3 J15.4 J15.5 J15.6 J15.7 J15.8 J15.9 J15.10 J15.11 6.64,49.12 8.55,49.12 11.6,52.17 | JP34.12 8.17,101.7 8.17,99.41 JP34.11 8.17,99.03 8.17,96.74 | 8.17,96.74 8.17,94.46 JP34.9 8.17,94.08 8.17,91.79 JP34.8 8.17,91.41 8.17,89.12 | 8.17,73.88 8.17,76.17 JP34.2 8.17,76.55 8.17,78.84 JP34.3 8.17,79.22 8.17,81.5 | 8.17,81.5 8.17,83.79 JP34.5 8.17,84.17 8.17,86.46 JP34.6 8.17,86.84 8.17,89.12 | 8.17,81.5 JP34.4 | 8.17,89.12 JP34.7 | 8.17,96.74 JP34.10 | 11.6,52.17 13.12,53.69 13.12,60.93 8.55,65.5 8.55,73.5 8.17,73.88 | 8.17,73.88 JP34.1 | JP33.12 57.7,101.7 57.7,99.41 JP33.11 57.7,99.03 57.7,96.74 | 57.7,96.74 57.7,94.46 JP33.9 57.7,94.08 57.7,91.79 JP33.8 57.7,91.41 57.7,89.12 | 57.7,81.5 57.7,79.22 JP33.3 57.7,78.84 57.7,76.55 JP33.2 57.7,76.17 57.7,73.88 JP33.1 57.32,73.88 57.32,68.93 54.65,66.26 54.65,63.21 51.98,60.55 51.98,54.07 53.89,52.17 | 57.7,81.5 57.7,83.79 JP33.5 57.7,84.17 57.7,86.46 JP33.6 57.7,86.84 57.7,89.12 | 57.7,81.5 JP33.4 | 57.7,89.12 JP33.7 | 57.7,96.74 JP33.10 | 60.75,39.59 60.75,41.88 J17.9 60.75,42.26 60.75,44.55 J17.10 60.75,44.93 60.75,47.21 J17.11 60.37,47.21 58.84,48.74 57.32,48.74 53.89,52.17 | 60.75,31.97 60.75,29.69 J17.4 60.75,29.31 60.75,27.02 J17.3 60.75,26.64 60.75,24.35 | v46.14,4.03 DC1.3 | 60.37,22.07 J17.1 | 60.75,24.35 60.75,22.07 J17.1 | 60.75,24.35 J17.2 | 60.75,31.97 60.75,34.26 J17.6 60.75,34.64 60.75,36.93 J17.7 60.75,37.31 60.75,39.59 | 60.75,31.97 J17.5 | 60.75,39.59 J17.8 | 11.6,52.17 13.63,48.86 41.32,48.86 | 53.89,52.17 50.59,48.86 41.32,48.86 | 41.32,48.86 v40.94,48.48 | v55.54,20.54 56.81,20.54 58.08,21.81 J17.1

### Text on the board
tNames: xnsense.no | xns ip67-ESP12 rev 1 | GND | 3.3V | 3.3V | GND | D15 | D13 | D2 | D12 | D0 | D14 | D4 | D16 | D5 | CHPD | ADC | RST | GND | 3.3V | 3.3V | GND
tValues: GND | RX | TX